# Altium schematic sheet SLS.SchDoc
size A4
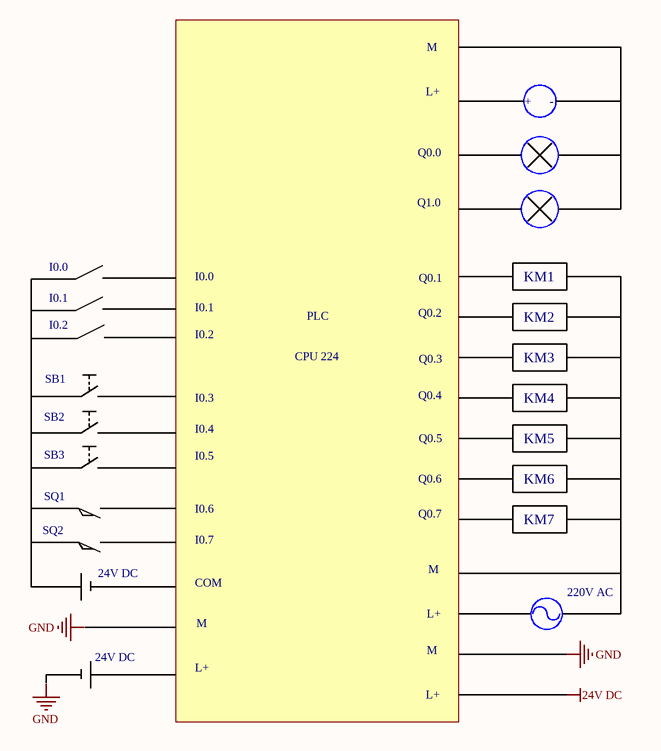
[diagram p0: SLS.SchDoc]

## Notes on the sheet
- M
- Q0.0
- L+
- +      -
- Q1.0
- I0.0
- Q0.1
- KM1
- I0.2
- I0.1
- CPU 224
- PLC
- Q0.2
- Q0.3
- KM2
- KM3
- SB2
- SB1
- I0.3
- Q0.4
- KM4
- SB3
- I0.5
- I0.4
- Q0.6
- Q0.5
- KM5
- KM6
- SQ2
- SQ1
- I0.7
- I0.6
- Q0.7
- KM7
- 24V DC
- COM
- 220V AC
- Labels drawn without touching a wire or pin: 24V DC, GND